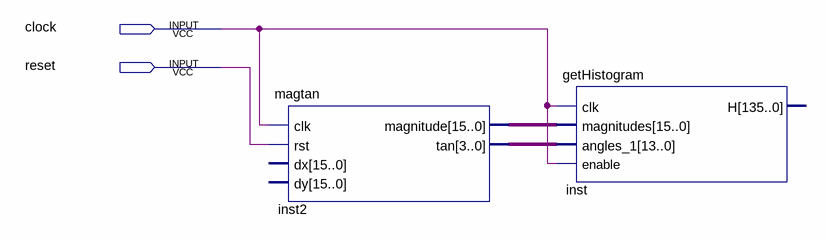
[diagram p0: schematic sheet]
// Quartus schematic human_detector.bdf as structural Verilog: 2 symbols, 2 pins
module human_detector (
  input  clock,
  input  reset
);

  wire [13:0] inst2_tan;
  wire [15:0] inst2_magnitude;

  magtan inst2 (.clk(clock), .rst(reset), .magnitude(inst2_magnitude), .tan(inst2_tan));  // open: dx, dy
  getHistogram inst (.clk(clock), .magnitudes(inst2_magnitude), .angles_1(inst2_tan), .enable(clock));  // open: H
endmodule
